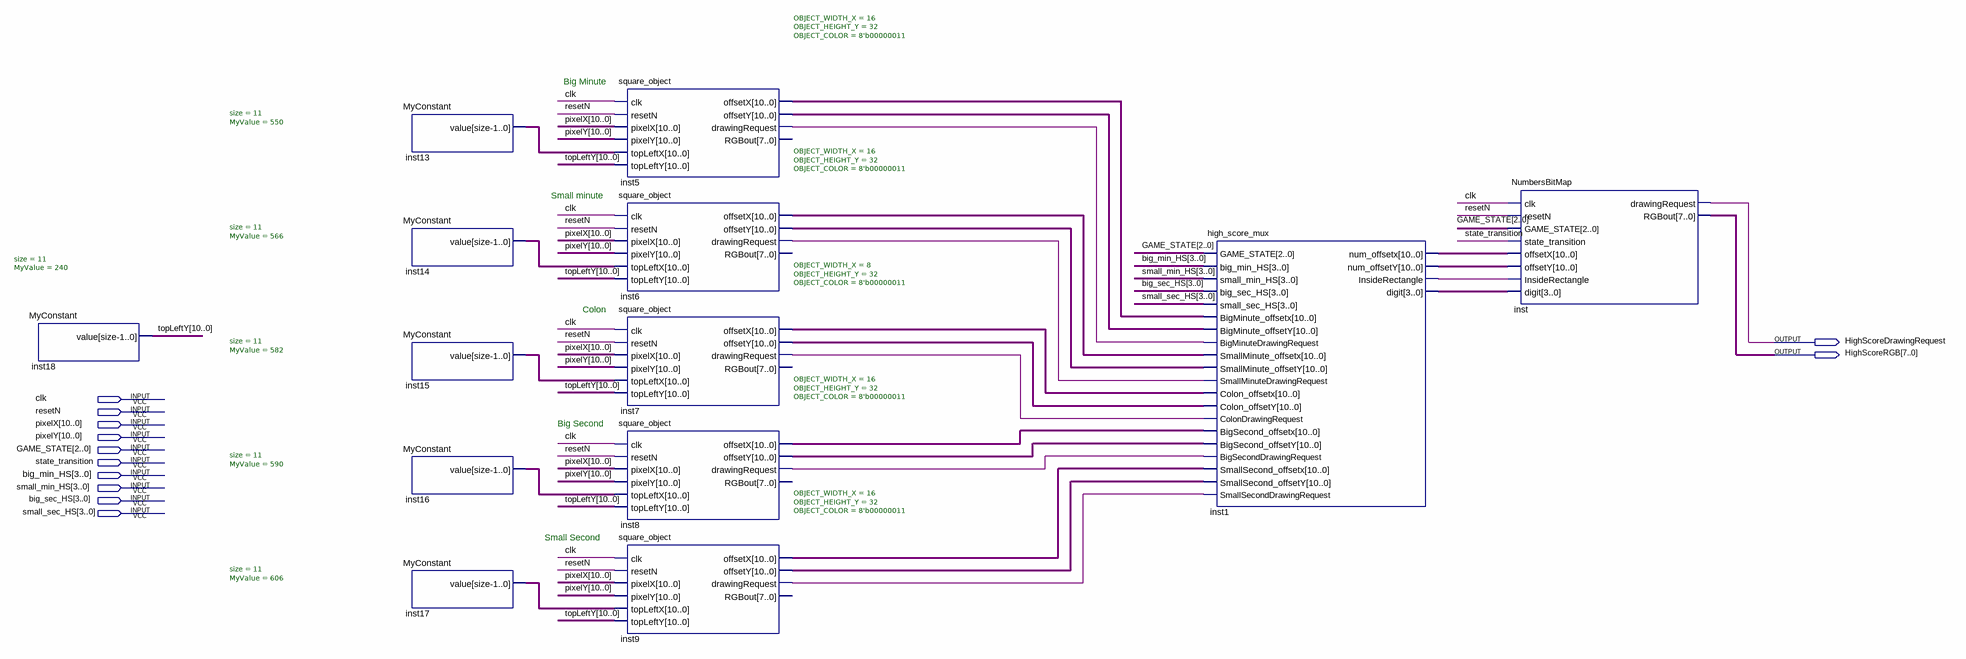
[diagram p0: schematic sheet]
// Quartus schematic HIGH_SCORE_DISPLAY.bdf as structural Verilog: 13 symbols, 12 pins
module HIGH_SCORE_DISPLAY (
  input  clk,
  input  resetN,
  input  [10:0] pixelX,
  input  [10:0] pixelY,
  input  [2:0] GAME_STATE,
  input  state_transition,
  input  [3:0] big_min_HS,
  input  [3:0] small_min_HS,
  input  [3:0] big_sec_HS,
  input  [3:0] small_sec_HS,
  output HighScoreDrawingRequest,
  output [7:0] HighScoreRGB
);

  wire inst1_insiderectangle, inst5_drawingrequest, inst6_drawingrequest, inst7_drawingrequest,
       inst8_drawingrequest, inst9_drawingrequest;
  wire [3:0] inst1_digit;
  wire [10:0] inst1_num_offsetx, inst1_num_offsety, inst5_offsetx, inst5_offsety, inst6_offsetx,
       inst6_offsety, inst7_offsetx, inst7_offsety, inst8_offsetx, inst8_offsety, inst9_offsetx,
       inst9_offsety, inst13_value, inst14_value, inst15_value, inst16_value, inst17_value, topLeftY;

  MyConstant #(.size(11), .MyValue(240)) inst18 (.value(topLeftY));
  MyConstant #(.size(11), .MyValue(550)) inst13 (.value(inst13_value));
  MyConstant #(.size(11), .MyValue(566)) inst14 (.value(inst14_value));
  MyConstant #(.size(11), .MyValue(582)) inst15 (.value(inst15_value));
  MyConstant #(.size(11), .MyValue(590)) inst16 (.value(inst16_value));
  MyConstant #(.size(11), .MyValue(606)) inst17 (.value(inst17_value));
  square_object #(.OBJECT_WIDTH_X(16), .OBJECT_HEIGHT_Y(32), .OBJECT_COLOR(8'b00000011)) inst5 (
    .clk(clk), .resetN(resetN), .pixelX(pixelX), .pixelY(pixelY), .topLeftX(inst13_value),
    .topLeftY(topLeftY), .offsetX(inst5_offsetx), .offsetY(inst5_offsety),
    .drawingRequest(inst5_drawingrequest));  // open: RGBout
  square_object #(.OBJECT_WIDTH_X(16), .OBJECT_HEIGHT_Y(32), .OBJECT_COLOR(8'b00000011)) inst6 (
    .clk(clk), .resetN(resetN), .pixelX(pixelX), .pixelY(pixelY), .topLeftX(inst14_value),
    .topLeftY(topLeftY), .offsetX(inst6_offsetx), .offsetY(inst6_offsety),
    .drawingRequest(inst6_drawingrequest));  // open: RGBout
  square_object #(.OBJECT_WIDTH_X(8), .OBJECT_HEIGHT_Y(32), .OBJECT_COLOR(8'b00000011)) inst7 (
    .clk(clk), .resetN(resetN), .pixelX(pixelX), .pixelY(pixelY), .topLeftX(inst15_value),
    .topLeftY(topLeftY), .offsetX(inst7_offsetx), .offsetY(inst7_offsety),
    .drawingRequest(inst7_drawingrequest));  // open: RGBout
  square_object #(.OBJECT_WIDTH_X(16), .OBJECT_HEIGHT_Y(32), .OBJECT_COLOR(8'b00000011)) inst8 (
    .clk(clk), .resetN(resetN), .pixelX(pixelX), .pixelY(pixelY), .topLeftX(inst16_value),
    .topLeftY(topLeftY), .offsetX(inst8_offsetx), .offsetY(inst8_offsety),
    .drawingRequest(inst8_drawingrequest));  // open: RGBout
  square_object #(.OBJECT_WIDTH_X(16), .OBJECT_HEIGHT_Y(32), .OBJECT_COLOR(8'b00000011)) inst9 (
    .clk(clk), .resetN(resetN), .pixelX(pixelX), .pixelY(pixelY), .topLeftX(inst17_value),
    .topLeftY(topLeftY), .offsetX(inst9_offsetx), .offsetY(inst9_offsety),
    .drawingRequest(inst9_drawingrequest));  // open: RGBout
  high_score_mux inst1 (
    .GAME_STATE(GAME_STATE), .big_min_HS(big_min_HS), .small_min_HS(small_min_HS), .big_sec_HS(big_sec_HS),
    .small_sec_HS(small_sec_HS), .BigMinute_offsetx(inst5_offsetx), .BigMinute_offsetY(inst5_offsety),
    .BigMinuteDrawingRequest(inst5_drawingrequest), .SmallMinute_offsetx(inst6_offsetx),
    .SmallMinute_offsetY(inst6_offsety), .SmallMinuteDrawingRequest(inst6_drawingrequest),
    .Colon_offsetx(inst7_offsetx), .Colon_offsetY(inst7_offsety), .ColonDrawingRequest(inst7_drawingrequest),
    .BigSecond_offsetx(inst8_offsetx), .BigSecond_offsetY(inst8_offsety),
    .BigSecondDrawingRequest(inst8_drawingrequest), .SmallSecond_offsetx(inst9_offsetx),
    .SmallSecond_offsetY(inst9_offsety), .SmallSecondDrawingRequest(inst9_drawingrequest),
    .num_offsetx(inst1_num_offsetx), .num_offsetY(inst1_num_offsety),
    .InsideRectangle(inst1_insiderectangle), .digit(inst1_digit));
  NumbersBitMap inst (
    .clk(clk), .resetN(resetN), .GAME_STATE(GAME_STATE), .state_transition(state_transition),
    .offsetX(inst1_num_offsetx), .offsetY(inst1_num_offsety), .InsideRectangle(inst1_insiderectangle),
    .digit(inst1_digit), .drawingRequest(HighScoreDrawingRequest), .RGBout(HighScoreRGB));

  // Notes on the sheet:
  //   Big Minute
  //   Small minute
  //   Colon
  //   Big Second
  //   Small Second
endmodule
